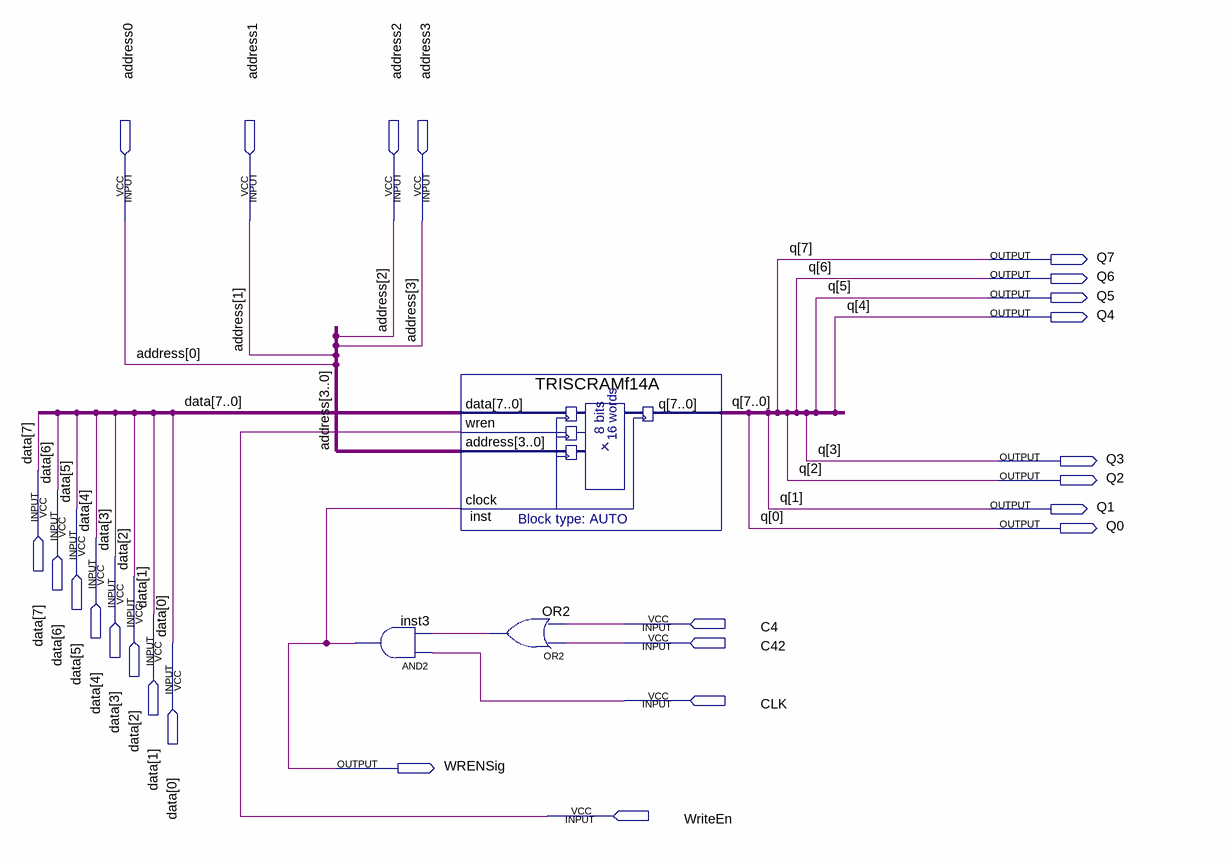
[diagram p0: schematic sheet]
// Quartus schematic pwm.bdf as structural Verilog: 3 symbols, 25 pins
module pwm (
  input  address0,
  input  address1,
  input  address2,
  input  address3,
  input  [7:0] data,
  input  C4,
  input  C42,
  input  CLK,
  input  WriteEn,
  output Q7,
  output Q6,
  output Q5,
  output Q4,
  output Q3,
  output Q2,
  output Q1,
  output Q0,
  output WRENSig
);

  wire OR2_out;

  and inst3 (WRENSig, CLK, OR2_out);
  TRISCRAMf14A inst (
    .data(data), .wren(WriteEn), .address({address3, address2, address1, address0}), .clock(WRENSig),
    .q({Q7, Q6, Q5, Q4, Q3, Q2, Q1, Q0}));
  or OR2 (OR2_out, C42, C4);
endmodule
